# EAGLE design well-siting-meter (EAGLE 9.1.0)
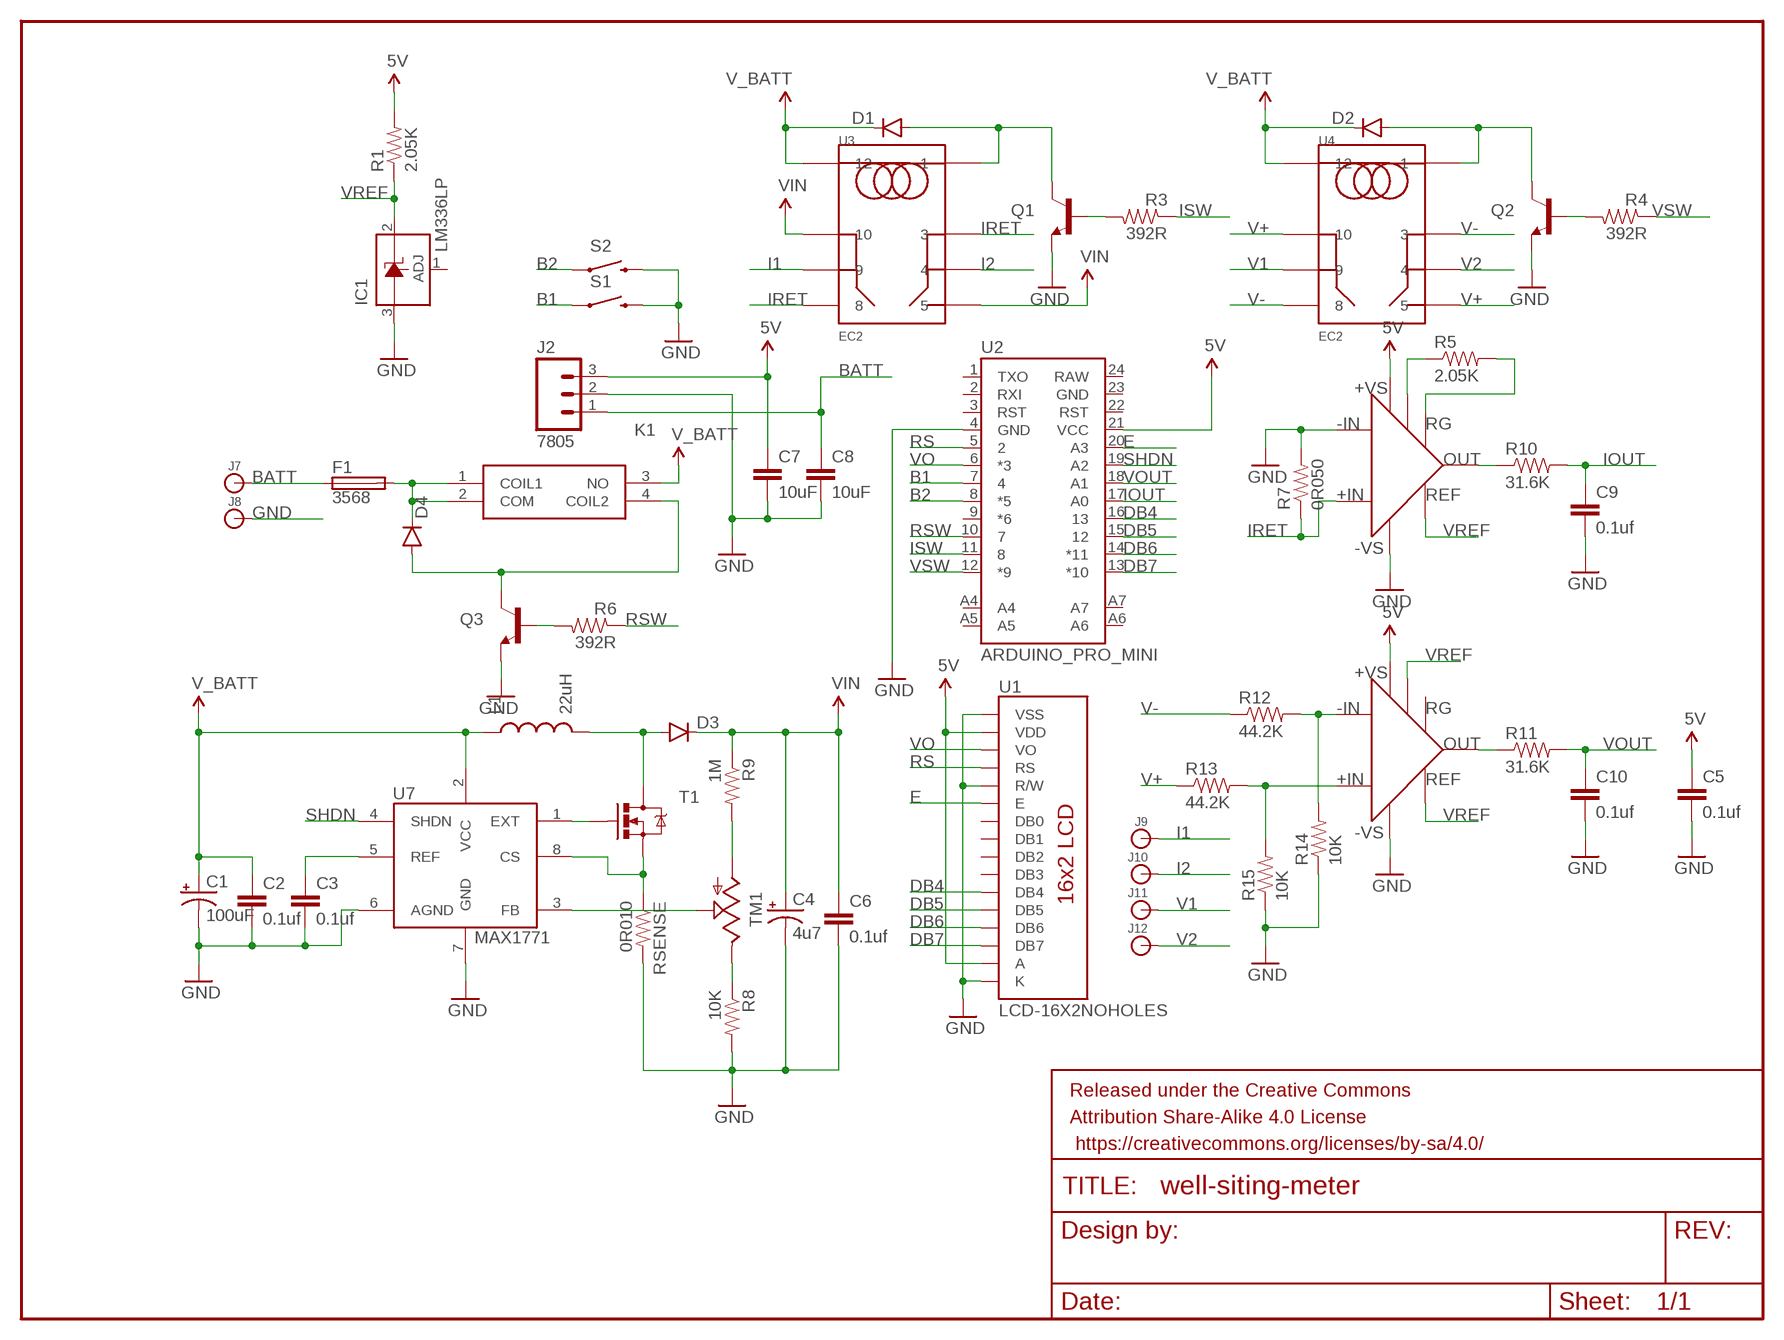
[diagram p0: schematic, sheet 1]

## Parts
C1  100uF  CAP_POLPTH4  [CPOL-RADIAL-1000UF-25V]
C2  0.1uf  CAPPTH1  [CAP-PTH-5MM]
C3  0.1uf  CAPPTH1  [CAP-PTH-5MM]
C4  4u7  CAP_POLPTH4  [CPOL-RADIAL-1000UF-25V]
C5  0.1uf  CAPPTH1  [CAP-PTH-5MM]
C6  0.1uf  CAPPTH1  [CAP-PTH-5MM]
C7  10uF  CAPPTH1  [CAP-PTH-5MM]
C8  10uF  CAPPTH1  [CAP-PTH-5MM]
C9  0.1uf  CAPPTH1  [CAP-PTH-5MM]
C10  0.1uf  CAPPTH1  [CAP-PTH-5MM]
D1  DIODEPTH  [DIODE-1N4001]
D2  DIODEPTH  [DIODE-1N4001]
D3  DIODEPTH  [DIODE-1N4001]
D4  DIODEPTH  [DIODE-1N4001]
F1  3568  [3568]
FRAME1  FRAME-LETTER  [CREATIVE_COMMONS]
IC1  LM336LP  [TO92]
J2  7805  M03PTH  [1X03]
J7  BANANA_CONN  [BANANA_CONN]
J8  BANANA_CONN  [BANANA_CONN]
J9  BANANA_CONN  [BANANA_CONN]
J10  BANANA_CONN  [BANANA_CONN]
J11  BANANA_CONN  [BANANA_CONN]
J12  BANANA_CONN  [BANANA_CONN]
K1  OJE-SH-105HM,000  [OJ-SH-124LMH]
L1  22uH  WE-FAMI  [1415]
Q1  TRANSISTOR_NPNTO92  [TO-92]
Q2  TRANSISTOR_NPNTO92  [TO-92]
Q3  TRANSISTOR_NPNTO92  [TO-92]
R1  2.05K  RESISTORPTH-1/4W  [AXIAL-0.4]
R3  392R  RESISTORPTH-1/4W  [AXIAL-0.4]
R4  392R  RESISTORPTH-1/4W  [AXIAL-0.4]
R5  2.05K  RESISTORPTH-1/4W  [AXIAL-0.4]
R6  392R  RESISTORPTH-1/4W  [AXIAL-0.4]
R7  0R050  RESISTORPTH-1W  [AXIAL-0.6]
R8  10K  RESISTORPTH-1/4W  [AXIAL-0.4]
R9  1M  RESISTORPTH-1/4W  [AXIAL-0.4]
R10  31.6K  RESISTORPTH-1/4W  [AXIAL-0.4]
R11  31.6K  RESISTORPTH-1/4W  [AXIAL-0.4]
R12  44.2K  RESISTORPTH-1/4W  [AXIAL-0.4]
R13  44.2K  RESISTORPTH-1/4W  [AXIAL-0.4]
R14  10K  RESISTORPTH-1/4W  [AXIAL-0.4]
R15  10K  RESISTORPTH-1/4W  [AXIAL-0.4]
RSENSE  0R010  RESISTORPTH-1W  [AXIAL-0.6]
S1  SWITCH-MOMENTARY-2PTH  [TACTILE-PTH]
S2  SWITCH-MOMENTARY-2PTH  [TACTILE-PTH]
T1  MOSFET-NCHANNELFQP30N06L  [TO220V]
TM1  TRIM3386  [TRIM-3386]
U1  LCD-16X2NOHOLES  [LCD-16X2_NOHOLES]
U2  ARDUINO_PRO_MINI  [ARDUINO_PRO_MINI]
U3  EC2  [EC2]
U4  EC2  [EC2]
U5  AD623  [DIP08]
U6  AD629  AD623  [DIP08]
U7  MAX1771  [DIP-08]

## Nets
5V: C5.1 C7.1 J2.3 R1.P$2 U1.2(VDD) U1.15(A) U2.21(VCC) U5.7(+VS) U6.7(+VS)
B1: S1.1 U2.7
B2: S2.1 U2.8(*5)
BATT: C8.1 F1.1 F1.2 J2.1 J7.P$1
DB4: U1.11(DB4) U2.16
DB5: U1.12(DB5) U2.15
DB6: U1.13(DB6) U2.14(*11)
DB7: U1.14(DB7) U2.13(*10)
E: U1.6(E) U2.20(A3)
FUSE: D4.C F1.3 F1.4 K1.1(COIL1) K1.2(COM)
GND: C1.2(-) C2.2 C3.2 C4.2(-) C5.2 C6.2 C7.2 C8.2 C9.2 C10.2 IC1.3(A) J2.2 J8.P$1 Q1.1(E) Q2.1(E) Q3.1(E) R7.P$2 R8.P$2 R14.P$1 R15.P$1 RSENSE.P$2 S1.3 S2.3 U1.1(VSS) U1.5(R/W) U1.16(K) U2.4(GND) U5.2(-IN) U5.4(-VS) U6.4(-VS) U7.6(AGND) U7.7(GND)
I1: J9.P$1 U3.9
I2: J10.P$1 U3.4
IOUT: C9.1 R10.P$2 U2.17(A0)
IRET: R7.P$1 U3.3 U3.8 U5.3(+IN)
ISW: R3.P$1 U2.11
N$1: D2.A Q2.3(C) U4.1
N$2: Q2.2(B) R4.P$2
N$4: D1.A Q1.3(C) U3.1
N$5: Q1.2(B) R3.P$2
N$6: R9.P$2 TM1.3(A)
N$7: C3.1 U7.5(REF)
N$8: R8.P$1 TM1.1(E)
N$9: D3.A L1.P2 T1.2(D)
N$10: T1.1(G) U7.1(EXT)
N$11: RSENSE.P$1 T1.3(S) U7.8(CS)
N$12: R10.P$1 U5.6(OUT)
N$13: R12.P$2 R14.P$2 U6.2(-IN)
N$14: R11.P$1 U6.6(OUT)
N$15: TM1.2(S) U7.3(FB)
N$16: R13.P$2 R15.P$2 U6.3(+IN)
N$17: D4.A K1.4(COIL2) Q3.3(C)
N$18: Q3.2(B) R6.P$2
N$24: R5.P$1 U5.1(-RG)
N$25: R5.P$2 U5.8(+RG)
RS: U1.4(RS) U2.5
RSW: R6.P$1 U2.10
SHDN: U2.19(A2) U7.4(SHDN)
V1: J11.P$1 U4.9
V2: J12.P$1 U4.4
V+: R13.P$1 U4.5 U4.10
V-: R12.P$1 U4.3 U4.8
V_BATT: C1.1(+) C2.1 D1.C D2.C K1.3(NO) L1.P1 U3.12 U4.12 U7.2(VCC)
VIN: C4.1(+) C6.1 D3.C R9.P$1 U3.5 U3.10
VO: U1.3(VO) U2.6(*3)
VOUT: C10.1 R11.P$2 U2.18(A1)
VREF: IC1.2(C) R1.P$1 U5.5(REF) U6.1(-RG) U6.5(REF)
VSW: R4.P$1 U2.12(*9)
Unconnected: IC1.1(ADJ) U1.7(DB0) U1.8(DB1) U1.9(DB2) U1.10(DB3) U2.1(TXO) U2.2(RXI) U2.3(RST) U2.9(*6) U2.22(RST) U2.23(GND) U2.24(RAW) U2.A4 U2.A5 U2.A6 U2.A7 U6.8(+RG)

## Library data of the parts
C1 = SparkFun-Passives:CAP_POL: Capacitor Polarized These are standard SMD and PTH capacitors. Normally 10uF, 47uF, and 100uF in electrolytic and tantalum varieties. Always verify the external diameter of the through hole cap, it varies with capacity, voltage, and manufacturer. The EIA devices should be standard.; PN: 1572-1306-ND
C2 C3 C5 C9 C10 = SparkFun-Passives:CAP: Capacitor Standard 0603 ceramic capacitor, and 0.1" leaded capacitor.; PN: BC2665CT-ND
C4 = SparkFun-Passives:CAP_POL: Capacitor Polarized These are standard SMD and PTH capacitors. Normally 10uF, 47uF, and 100uF in electrolytic and tantalum varieties. Always verify the external diameter of the through hole cap, it varies with capacity, voltage, and manufacturer. The EIA devices should be standard.; PN: 399-6091-ND
C6 = SparkFun-Passives:CAP: Capacitor Standard 0603 ceramic capacitor, and 0.1" leaded capacitor.; PN: 445-173449-1-ND
C7 C8 = SparkFun-Passives:CAP: Capacitor Standard 0603 ceramic capacitor, and 0.1" leaded capacitor.; PN: 445-173437-1-ND
D1 D2 D4 = SparkFun-DiscreteSemi:DIODE: Diode These are standard reverse protection diodes and small signal diodes. SMA package can handle up to about 1A. SOD-323 can handle about 200mA. What the SOD-323 package when ordering, there are some mfgs out there that are 5-pin packages.; PN: 1N4001-TPMSCT-ND
D3 = SparkFun-DiscreteSemi:DIODE: Diode These are standard reverse protection diodes and small signal diodes. SMA package can handle up to about 1A. SOD-323 can handle about 200mA. What the SOD-323 package when ordering, there are some mfgs out there that are 5-pin packages.; PN: EGP20FCT-ND
F1 = keystone:3568; PN: 36-3568-ND
FRAME1 = SparkFun-Aesthetics:FRAME-LETTER: Schematic Frame Standard 8.5x11 US Letter frame
IC1 = linear:LM336: 2.5-V INTEGRATED REFERENCE CIRCUITS LM236 Source: http://focus.ti.com/lit/ds/symlink/lm336-2.5.pdf; PN: LM336Z25-ND
J2 = SparkFun-Connectors:M03: Header 3 Standard 3-pin 0.1" header. Use with straight break away headers (SKU : PRT-00116), right angle break away headers (PRT-00553), swiss pins (PRT-00743), machine pins (PRT-00117), and female headers (PRT-00115). Molex polarized connector foot print use with SKU : PRT-08232 with associated crimp pins and housings.; PN: 811-2196-5-ND; PN2: LM7805CT-ND
J7 J9 J11 = SparkFun-Connectors:BANANA_CONN: Through-hole banana jack; PN: 1568-1664-ND
J8 J10 J12 = SparkFun-Connectors:BANANA_CONN: Through-hole banana jack; PN: 1568-1665-ND
K1 = oje:OJE-SH-105HM,000: Power Relay,PCB,SPST,10A,5Vdc TE Connectivity SPNO PCB Mount Non-Latching Relay, 5V dc Coil, 10 A General Purpose Relay Source: Datasheet <http://www.te.com/commerce/DocumentDelivery/DDEController?Action=showdoc&DocId=Data SheetOJ_OJE_series_relay_data_sheet_E0214pdfEnglishENG_DS_OJ_OJE_series_relay_data_sheet_E_0214_OJ.pdf1461402-4>; ARROW_PART_NUMBER: OJE-SH-105HM,000; ARROW_PRICE/STOCK: http://uk.rs-online.com/web/p/products/1639319; DESCRIPTION: Power Relay,PCB,SPST,10A,5Vdc TE Connectivity SPNO PCB Mount Non-Latching Relay, 5V dc Coil, 10 A General Purpose Relay; HEIGHT: mm; MANUFACTURER_NAME: TE Connectivity; MANUFACTURER_PART_NUMBER: OJE-SH-105HM,000; PN: PB876-ND; RS_PART_NUMBER: 1639319; RS_PRICE/STOCK: http://uk.rs-online.com/web/p/products/1639319
L1 = misc:WE-FAMI; PN: 732-7163-ND
Q1-Q3 = SparkFun-DiscreteSemi:TRANSISTOR_NPN: Generic NPN BJT MMBT2222A - TRANS-08049 (SOT-23, 1A 40V) MPSA42 - TRANS-09116 (SOT-23, 500mA 300V) MMBT5088LT1G - TRANS-11160 (SOT-23, 50 mA 30V) BC547 - COM-08928 <http://www.sparkfun.com/products/8928> (TO-92 45V 100mA) (1.Collector 2.Base 3.Emitter) 2N3904 - COM-00521 <http://www.sparkfun.com/products/521> (TO-92 40V 200mA) (1.Emitter 2.Base 3.Collector) P2N2222A - COM-12852 <http://www.sparkfun.com/products/12852> (TO-92 40V 600mA) (1.Collector 2.Base 3.Emitter); PN: PN2222AFS-ND
R1 R5 = SparkFun-Passives:RESISTOR: Resistor Basic schematic elements and footprints for 0603, 1206, and PTH resistors.; PN: 2.05KXBK-ND
R3 R4 R6 = SparkFun-Passives:RESISTOR: Resistor Basic schematic elements and footprints for 0603, 1206, and PTH resistors.; PN: 392XBK-ND
R7 = SparkFun-Passives:RESISTOR: Resistor Basic schematic elements and footprints for 0603, 1206, and PTH resistors.; PN: 696-1731-ND
R8 R14 R15 = SparkFun-Passives:RESISTOR: Resistor Basic schematic elements and footprints for 0603, 1206, and PTH resistors.; PN: 10.0KXBK-ND
R9 = SparkFun-Passives:RESISTOR: Resistor Basic schematic elements and footprints for 0603, 1206, and PTH resistors.; PN: 1.00MXBK-ND
R10 R11 = SparkFun-Passives:RESISTOR: Resistor Basic schematic elements and footprints for 0603, 1206, and PTH resistors.; PN: 31.6KXBK-ND
R12 R13 = SparkFun-Passives:RESISTOR: Resistor Basic schematic elements and footprints for 0603, 1206, and PTH resistors.; PN: 44.2KXBK-ND
RSENSE = SparkFun-Passives:RESISTOR: Resistor Basic schematic elements and footprints for 0603, 1206, and PTH resistors.; PN: 696-1729-ND
S1 S2 = SparkFun-Electromechanical:SWITCH-MOMENTARY-2: Various NO switches- pushbuttons, reed, etc; PN: SW406-ND; PROD_ID: SWCH-08441
T1 = SparkFun-DiscreteSemi:MOSFET-NCHANNEL: Common NMOSFET Parts MFG P/N Store ID Prod ID FDD8780 TRANS-09984 SI7820DN TRANS-11055 FDS6630A IC-08089 2N7002PW TRANS-11151 FQP30N06L COM-10213 TRANS-10060 BSS123LT1G TRANS-08345 BSS138 TRANS-00830 BS170 2N7000; PN: FDP33N25-ND; PROD_ID: TRANS-10060
TM1 = adafruit:TRIM; PN: 1528-1997-ND
U1 = SparkFun-Displays:LCD-16X2: Standard text-only 16x2 parallel input LCD; PN: 1528-1502-ND
U2 = SparkFun-Boards:ARDUINO_PRO_MINI; PN: 1568-1055-ND
U3 U4 = ec2:EC2; PN: 399-11029-5-ND
U5 = ad623:AD623; PN: AD623ANZ-ND
U6 = ad623:AD623; PN: AD629ANZ-ND
U7 = max1771:MAX1771; PN: MAX1771CPA+-ND

## Board
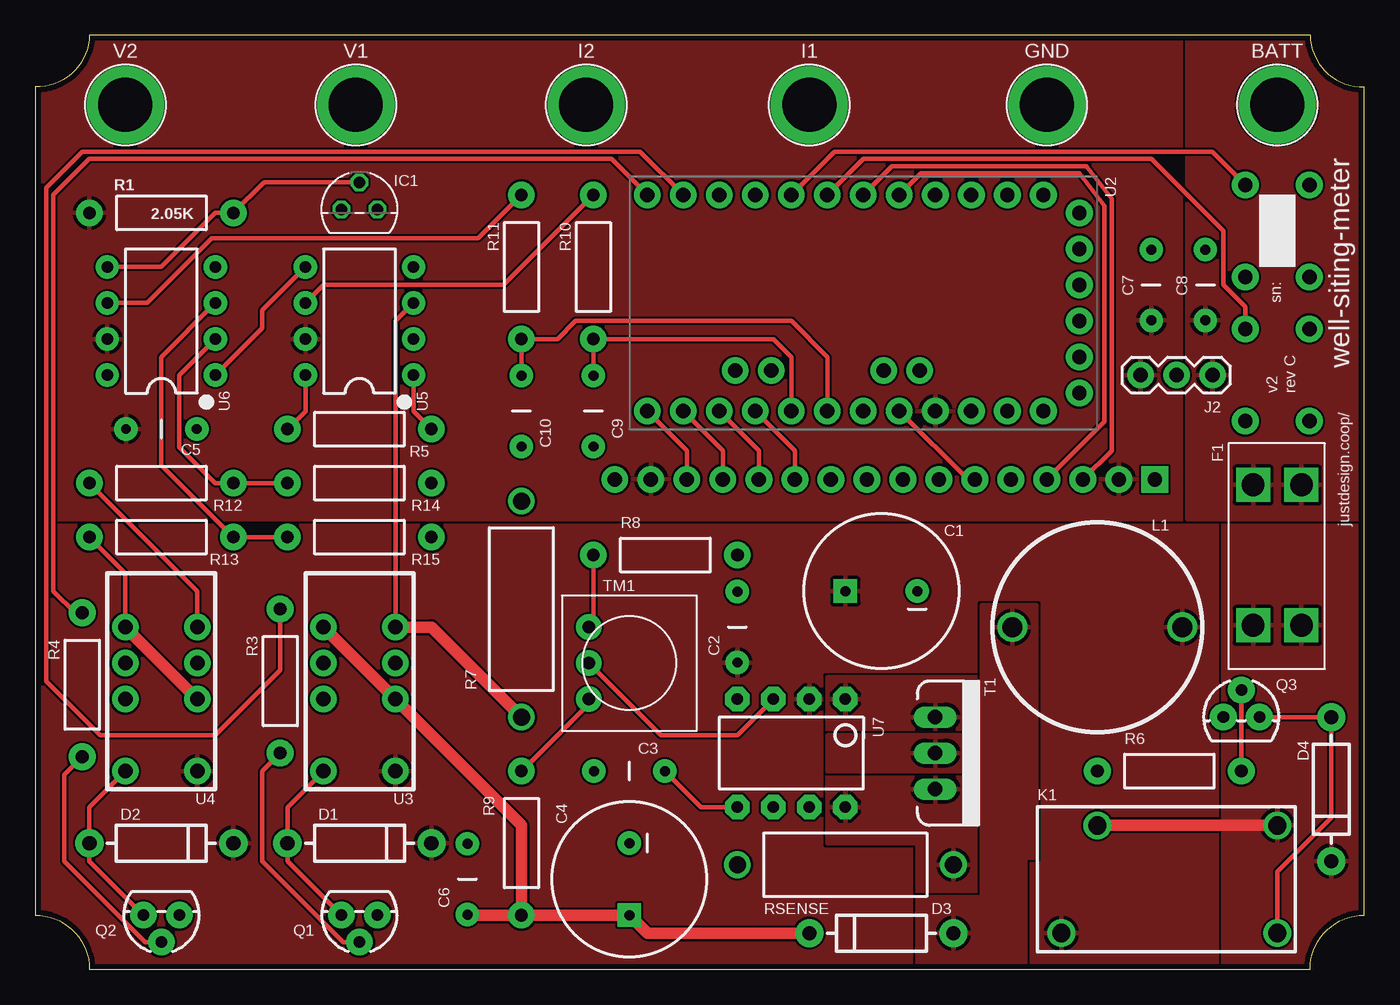
[diagram p1: board, top side]
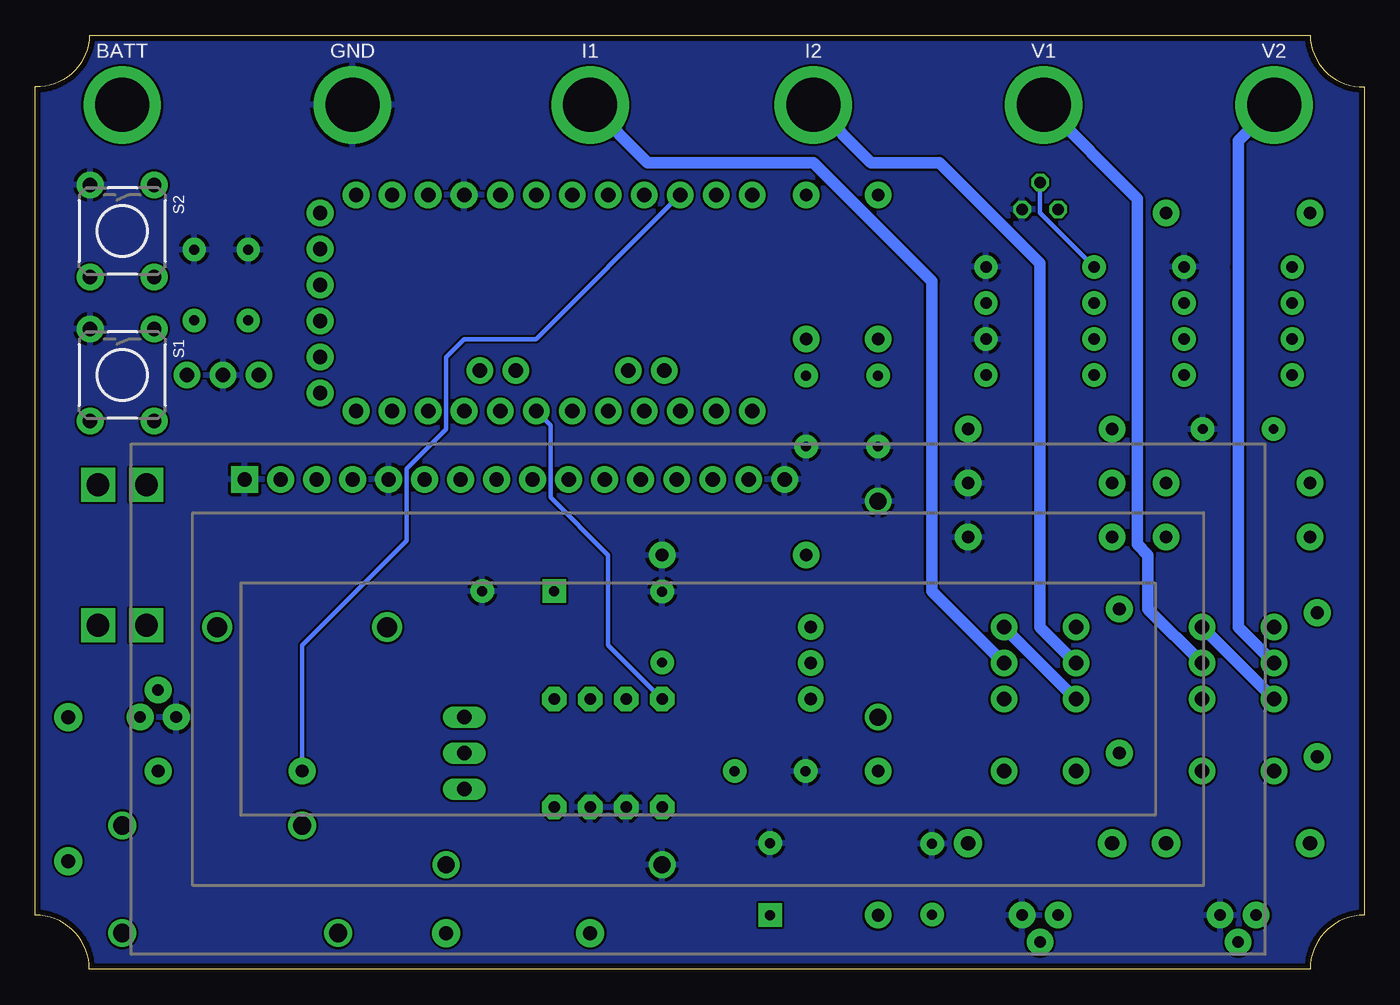
[diagram p2: board, bottom side, seen from below]

Size 93.75 x 65.86 mm. Coordinates in mm from the lower left corner, seen from the top.
Outline: 3.81,0 89.94,0 arc-90 93.75,3.81 93.75,62.23 arc-90 89.94,65.86 3.81,65.86 arc-90 0,62.23 0,3.81 arc-90 3.81,0
Copper layers (1*16): Top 0.035559375mm / dielectric 1.6mm / Bottom 0.035559375mm
Design rules "oshpark-2layer": minimum track width 6mil, minimum drill 10mil, track to track 6mil, track to pad 6mil, pad to pad 6mil, via to via 6mil, smd to smd 6mil, copper to edge 15mil, drill to drill 6mil, minimum pad ring 5mil, minimum via ring 5mil, stop-mask expansion 2.5mil, vias tented up to drill 0mil, thermal gap 10mil

### Footprints (pad centres in the part's own frame; a part is rotated, then mirrored left to right if it is on the bottom)
CPOL-RADIAL-1000UF-25V = drill 0.7 pad 1.651 square: 1 2.54,0 | drill 0.7 pad 1.651: 2 -2.54,0
CAP-PTH-5MM = drill 0.7 pad 1.651: 1 -2.5,0; 2 2.5,0
DIODE-1N4001 = drill 1 pad 1.981: A -5.08,0; C 5.08,0
3568 = drill 1.6 square: 1 -4.953,1.702; 2 -4.953,-1.702; 3 4.953,1.702; 4 4.953,-1.702
TO92 = drill 0.813 octagon: 1 -1.27,0; 2 0,1.905; 3 1.27,0
1X03 = drill 1.016 pad 1.88: 1 0,0; 2 2.54,0; 3 5.08,0
BANANA_CONN = drill 3.81 pad 5.461: P$1 0,0
OJ-SH-124LMH = drill 1.3 pad 1.95: 1 -15.24,-7.6; 2 -2.54,-7.6; 3 0,0; 4 -15.24,0
1415 = drill 1.4: P1 -6,0; P2 6,0
TO-92 = drill 0.813 pad 1.88: 1 -1.27,0; 2 0,1.905; 3 1.27,0
AXIAL-0.4 = drill 0.9 pad 1.88: P$1 -5.08,0; P$2 5.08,0
AXIAL-0.6 = drill 1.2 pad 1.88: P$1 -7.62,0; P$2 7.62,0
TACTILE-PTH = drill 1.016 pad 1.88: 1 -3.251,2.261; 2 3.251,2.261; 3 -3.251,-2.261; 4 3.251,-2.261
TO220V = drill 1.016 long: 1 -2.54,0; 2 0,0; 3 2.54,0
TRIM-3386 = drill 0.9 pad 1.778: 1 -2.54,-2.857; 2 0,-2.857; 3 2.54,-2.857
LCD-16X2_NOHOLES = drill 1.016 pad 1.88 square: 1 -32,15.5 | drill 1.016 pad 1.88: 2 -29.46,15.5; 3 -26.92,15.5; 4 -24.38,15.5; 5 -21.84,15.5; 6 -19.3,15.5; 7 -16.76,15.5; 8 -14.22,15.5; 9 -11.68,15.5; 10 -9.14,15.5; 11 -6.6,15.5; 12 -4.06,15.5; 13 -1.52,15.5; 14 1.02,15.5; 15 3.56,15.5; 16 6.1,15.5
ARDUINO_PRO_MINI = drill 1.016 pad 1.88: 1 -7.62,12.7; 2 -7.62,10.16; 3 -7.62,7.62; 4 -7.62,5.08; 5 -7.62,2.54; 6 -7.62,0; 7 -7.62,-2.54; 8 -7.62,-5.08; 9 -7.62,-7.62; 10 -7.62,-10.16; 11 -7.62,-12.7; 12 -7.62,-15.24; 13 7.62,-15.24; 14 7.62,-12.7; 15 7.62,-10.16; 16 7.62,-7.62; 17 7.62,-5.08; 18 7.62,-2.54; 19 7.62,0; 20 7.62,2.54; 21 7.62,5.08; 22 7.62,7.62; 23 7.62,10.16; 24 7.62,12.7; A4 4.763,1.429; A5 4.763,3.969; A6 4.763,-9.049; A7 4.763,-6.509; BLK -6.35,15.24; GND -3.81,15.24; GRN 6.35,15.24; RXI 1.27,15.24; TXO 3.81,15.24; VCC -1.27,15.24
EC2 = drill 1.016 pad 1.88: 1 2.54,6.35; 3 2.54,1.27; 4 2.54,-1.27; 5 2.54,-3.81; 8 -2.54,-3.81; 9 -2.54,-1.27; 10 -2.54,1.27; 12 -2.54,6.35
DIP08 = drill 0.813 pad 1.626: 1 -3.81,-3.81; 2 -1.27,-3.81; 3 1.27,-3.81; 4 3.81,-3.81; 5 3.81,3.81; 6 1.27,3.81; 7 -1.27,3.81; 8 -3.81,3.81
DIP-08 = drill 0.813 pad 1.727 octagon: 1 -3.81,-3.81; 2 -1.27,-3.81; 3 1.27,-3.81; 4 3.81,-3.81; 5 3.81,3.81; 6 1.27,3.81; 7 -1.27,3.81; 8 -3.81,3.81

### Placement (x,y rotation side)
C1  59.69,26.67 180 top
C2  49.53,24.13 90 top
C3  41.91,13.97 180 top
C4  41.91,6.35 270 top
C5  8.89,38.1 0 top
C6  30.48,6.35 90 top
C7  78.74,48.26 90 top
C8  82.55,48.26 90 top
C9  39.37,39.37 270 top
C10  34.29,39.37 270 top
D1  22.86,8.89 0 top
D2  8.89,8.89 0 top
D3  59.69,2.54 180 top
D4  91.44,12.7 270 top
F1  87.63,29.21 270 top
FRAME1  12.7,72.39 0 top  (outside the outline)
IC1  22.86,53.59 0 top
J2  83.06,41.91 180 top
J7  87.63,60.96 0 top
J8  71.37,60.96 0 top
J9  54.61,60.96 0 top
J10  38.86,60.96 0 top
J11  22.61,60.96 0 top
J12  6.35,60.96 0 top
K1  72.39,2.54 180 top
L1  74.93,24.13 180 top
Q1  22.86,3.81 180 top
Q2  8.89,3.81 180 top
Q3  85.09,17.78 0 top
R1  8.89,53.34 180 top
R3  17.27,20.32 270 top
R4  3.3,20.07 270 top
R5  22.86,38.1 180 top
R6  80.01,13.97 0 top
R7  34.29,25.4 90 top
R8  44.45,29.21 0 top
R9  34.29,8.89 90 top
R10  39.37,49.53 270 top
R11  34.29,49.53 270 top
R12  8.89,34.29 0 top
R13  8.89,30.48 0 top
R14  22.86,34.29 180 top
R15  22.86,30.48 180 top
RSENSE  57.15,7.37 180 top
S1  87.63,41.91 270 bottom
S2  87.63,52.07 270 bottom
T1  63.5,15.24 270 top
TM1  41.91,21.59 270 top
U1  46.99,19.05 0 bottom
U2  58.42,46.99 270 top
U3  22.86,20.32 180 top
U4  8.89,20.32 180 top
U5  22.86,45.72 90 top
U6  8.89,45.72 90 top
U7  53.34,15.24 180 top

### Tracks (layer width: path | path; a pad name or v marks a point on that pad's centre or on a via)
5V
  pour Top (rank 2): -1.27,67.31 81.28,67.31 81.28,31.75 -1.27,31.75
B1
  Top 0.305: U2.7 58.42,57.15 78.74,57.15 83.82,52.07 83.82,48.26 85.37,46.71 S1.1
B2
  Top 0.305: U2.8 56.39,57.66 83.03,57.66 S2.1
BATT
  pour Top: 81.28,31.75 95.25,31.75 95.25,67.31 81.28,67.31
DB4
  Top 0.305: U2.16 53.59,36.58 U1.11
DB5
  Top 0.305: U2.15 51.05,36.58 U1.12
DB6
  Top 0.305: U2.14 48.51,36.58 U1.13
DB7
  Top 0.305: U2.13 45.97,36.58 U1.14
E
  Top 0.305: U1.6 65.78,34.55 U2.20
FUSE
  Top 0.813: K1.1 K1.2
  pour Top (rank 4): 95.25,31.75 83.82,31.75 83.82,-1.27 95.25,-1.27
GND
  pour Bottom: -2.54,68.58 96.52,68.58 96.52,-3.81 -2.54,-3.81
I1
  Bottom 0.813: U3.9 30.48,26.67 30.48,48.51 38.86,56.9 50.55,56.9 J9.P$1
I2
  Bottom 0.813: U3.4 22.86,24.13 22.86,49.78 29.97,56.9 34.8,56.9 J10.P$1
IOUT
  Top 0.305: C9.1 R10.P$2 52.07,44.45 53.34,43.18 U2.17
IRET
  Top 0.305: U5.3 25.4,45.72 U3.8
  Top 0.813: U3.8 27.94,24.13 R7.P$1
  Bottom 0.813: U3.3 U3.8
ISW
  Top 0.305: U2.11 42.67,57.66 3.3,57.66 0.76,55.12 0.76,20.32 4.57,16.51 12.7,16.51 17.27,21.08 R3.P$1
N$1
  Top 0.305: Q2.3 3.81,7.62 D2.A 3.81,11.43 U4.1
N$2
  Top 0.305: R4.P$2 2.03,13.72 2.03,7.62 7.75,1.91 Q2.2
N$4
  Top 0.305: Q1.3 17.78,7.62 D1.A 17.78,11.43 U3.1
N$5
  Top 0.305: R3.P$2 16,13.97 16,7.62 21.72,1.91 Q1.2
N$6
  Top 0.305: R9.P$2 39.05,18.73 TM1.3
N$7
  Top 0.305: C3.1 46.95,11.43 U7.5
N$8
  Top 0.305: TM1.1 39.37,24.45 R8.P$1
N$9
  pour Top: 55.88,13.97 66.8,13.97 66.8,5.08 62.23,5.08 62.23,-1.27 69.85,-1.27 69.85,7.87 70.61,7.87 70.61,25.65 66.8,25.65 66.8,16.51 55.88,16.51
N$10
  pour Top (rank 2): 55.88,16.51 55.88,20.57 66.8,20.57 66.8,16.51
N$11
  pour Top (rank 3): 55.88,13.97 55.88,8.89 62.23,8.89 62.23,5.08 66.8,5.08 66.8,13.97
N$12
  Top 0.305: R10.P$1 33.02,48.26 20.32,48.26 U5.6
N$13
  Top 0.305: R14.P$2 R12.P$2 12.7,34.29 10.16,36.83 10.16,41.91 U6.2
N$14
  Top 0.305: R11.P$1 31.24,51.56 12.45,51.56 7.87,46.99 U6.6
N$15
  Top 0.305: U7.3 49.53,16.51 44.13,16.51 TM1.2
N$16
  Top 0.305: R15.P$2 R13.P$2 8.89,35.56 8.89,43.18 U6.3
N$17
  Top 0.305: K1.4 87.63,6.86 91.44,10.67 D4.A Q3.3
N$18
  Top 0.305: R6.P$2 Q3.2
N$24
  Top 0.305: U5.1 26.67,39.37 R5.P$1
N$25
  Top 0.305: U5.8 19.05,39.37 R5.P$2
RS
  Top 0.305: U2.5 62.48,56.13 73.66,56.13 75.44,53.85 75.44,38.62 U1.4
RSW
  Bottom 0.305: R6.P$1 74.93,22.86 67.56,30.23 67.56,35.31 64.77,38.1 64.77,43.18 63.5,44.45 58.42,44.45 U2.10
SHDN
  Bottom 0.305: U2.19 57.4,38.35 57.4,33.27 53.34,29.21 53.34,22.86 U7.4
V1
  Bottom 0.813: U4.9 15.24,25.4 15.24,29.21 16,29.97 16,54.36 J11.P$1
V2
  Bottom 0.813: J12.P$1 8.89,58.42 8.89,49.53 8.89,24.13 U4.4
V+
  Top 0.305: U4.5 6.35,27.94 R13.P$1
  Top 0.813: U4.5 U4.10
V-
  Top 0.305: U4.8 11.43,26.67 R12.P$1
  Bottom 0.813: U4.3 U4.8
V_BATT
  pour Top (rank 5): -1.27,31.75 83.82,31.75 83.82,-2.54 -1.27,-2.54
VIN
  Top 0.813: U3.5 U3.10 34.29,10.16 R9.P$1 | C6.1 30.52,3.81 R9.P$1 | R9.P$1 C4.1 43.18,2.54 D3.C
VO
  Top 0.305: U2.6 60.45,56.64 74.17,56.64 75.94,54.36 75.94,36.58 U1.3
VOUT
  Top 0.305: C10.1 R11.P$2 36.83,44.45 38.1,45.72 53.34,45.72 55.88,43.18 U2.18
VREF
  Top 0.305: U5.5 16,46.48 16,45.21 U6.1 | U6.5 8.89,49.53 12.7,53.34 R1.P$1 16.13,55.5 IC1.2
  Bottom 0.305: IC1.2 22.86,53.34 U5.5
VSW
  Top 0.305: U2.12 40.64,57.15 3.81,57.15 1.27,54.61 1.27,26.67 2.79,25.15 R4.P$1

### Text on the board
_tsilk: V2 | V1 | I2 | I1 | GND | BATT | sn: | well-siting-meter | v2 | rev C | justdesign.coop/
_bsilk: V2 | V1 | I2 | I1 | GND | BATT